# EAGLE design SensorBoard_WiiCam (EAGLE 6.3)

## Sheet 1 of 2
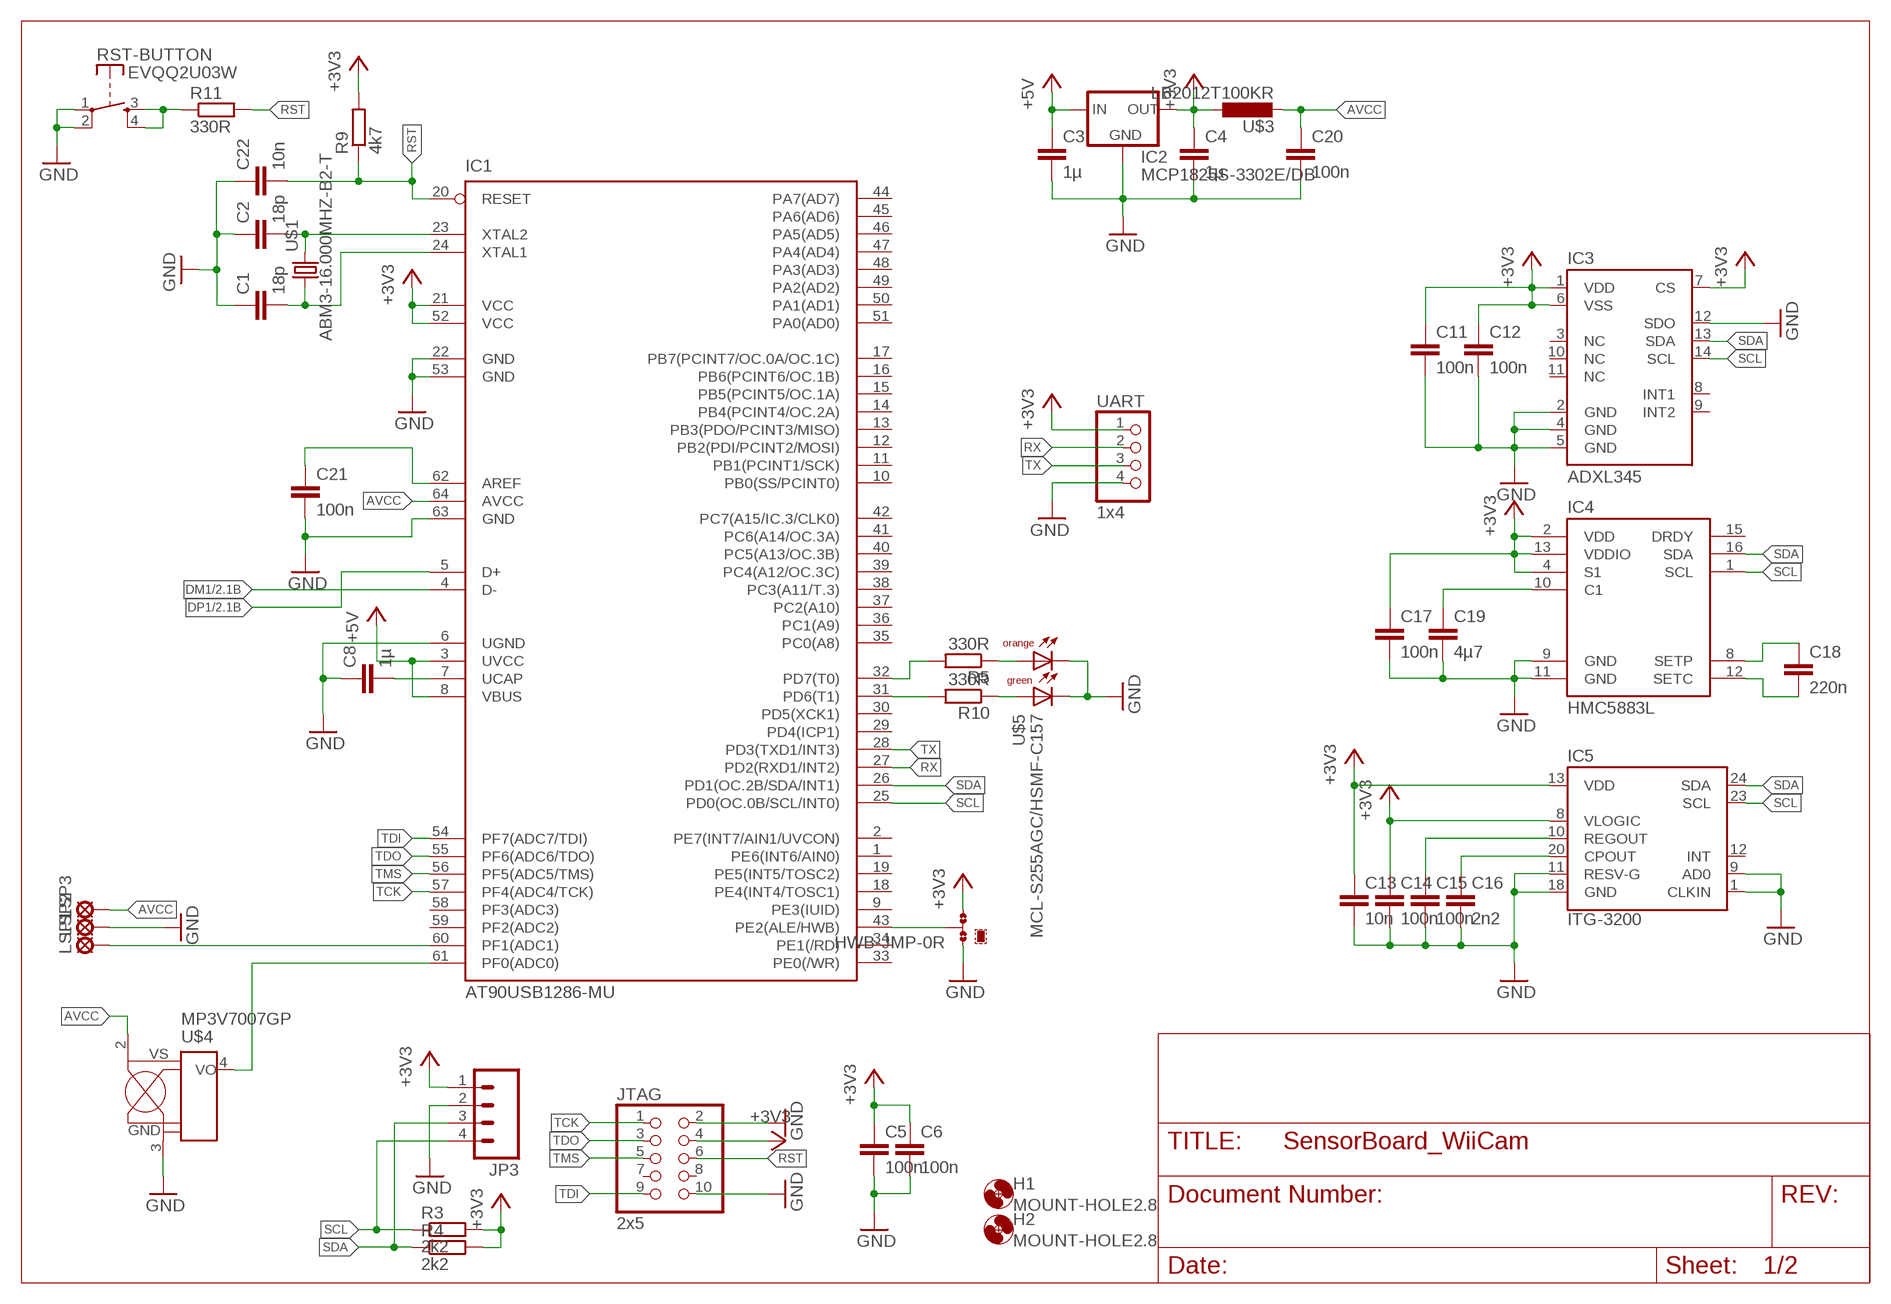
[diagram p0: schematic, sheet 1]

### Parts
C1  18p  C-EUC0603K  [C0603K]
C2  18p  C-EUC0603K  [C0603K]
C3  1µ  C-EUC0603K  [C0603K]
C4  1µ  C-EUC0603K  [C0603K]
C5  100n  C-EUC0603K  [C0603K]
C6  100n  C-EUC0603K  [C0603K]
C8  1µ  C-EUC0603K  [C0603K]
C11  100n  C-EUC0603K  [C0603K]
C12  100n  C-EUC0603K  [C0603K]
C13  10n  C-EUC0603K  [C0603K]
C14  100n  C-EUC0603K  [C0603K]
C15  100n  C-EUC0603K  [C0603K]
C16  2n2  C-EUC0603K  [C0603K]
C17  100n  C-EUC0603K  [C0603K]
C18  220n  C-EUC0603K  [C0603K]
C19  4µ7  C-EUC0603K  [C0603K]
C20  100n  C-EUC0603K  [C0603K]
C21  100n  C-EUC0603K  [C0603K]
C22  10n  C-EUC0603K  [C0603K]
H1  MOUNT-HOLE2.8  [2,8]
H2  MOUNT-HOLE2.8  [2,8]
HWB-JMP  0R-JUMPB  [B0R-JMP]
IC1  AT90USB1286-MU  AT90USB1287-AU  [TQFP64]
IC2  MCP1825S-3302E/DB  MCP1825-SOT223  [SOT223]
IC3  ADXL345  [LGA14]
IC4  HMC5883L  [LPCC16]
IC5  ITG-3200  [QFN-24]
JP3  M04PTH  [1X04]
JTAG  2x5  PINHD-2X5  [2X05]
LSP1  NC  SE14  [SE14]
LSP2  NC  SE14  [SE14]
LSP3  NC  SE14  [SE14]
R3  2k2  R-EU_R0603  [R0603]
R4  2k2  R-EU_R0603  [R0603]
R5  330R  R-EU_R0603  [R0603]
R9  4k7  R-EU_R0603  [R0603]
R10  330R  R-EU_R0603  [R0603]
R11  330R  R-EU_R0603  [R0603]
RST-BUTTON  EVQQ2U03W  SWITCH-SPNO  [EVQQ2]
U$1  ABM3-16.000MHZ-B2-T  TXC_ABM3  [SMD_5X3.2MM]
U$3  LB2012T100KR  L-TAIYO-YUDEN  [L-2012]
U$4  MP3V7007GP  [SOP-8]
U$5  MCL-S255AGC/HSMF-C157  DUOLED-MULTICOMP  [DUOLED-1210]
UART  1x4  PINHD-1X4  [1X04]

### Nets
+3V3: C4.1 C5.1 C6.1 C11.1 C12.1 C13.1 C14.1 C17.1 HWB-JMP.3 IC1.21(VCC) IC1.52(VCC) IC2.3(OUT) IC3.1(VDD) IC3.6(VSS) IC3.7(CS) IC4.2(VDD) IC4.4(S1) IC4.13(VDDIO) IC5.8(VLOGIC) IC5.13(VDD) JP3.1 JTAG.4 R3.2 R4.2 R9.2 U$3.1 UART.1 ; also sheet 2
+5V: C3.1 IC1.3(UVCC) IC1.8(VBUS) IC2.1(IN) ; also sheet 2
AVCC: C20.1 IC1.64(AVCC) LSP3.MP U$3.2 U$4.2(VS)
DM1: IC1.4(D-) ; also sheet 2
DP1: IC1.5(D+) ; also sheet 2
GND: C1.1 C2.1 C3.2 C4.2 C5.2 C6.2 C8.1 C11.2 C12.2 C13.2 C14.2 C15.2 C16.2 C17.2 C19.2 C20.2 C21.2 C22.1 HWB-JMP.1 IC1.6(UGND) IC1.22(GND) IC1.53(GND) IC1.63(GND) IC2.2(GND) IC2.4(GND) IC3.2(GND) IC3.4(GND) IC3.5(GND) IC3.12(SDO) IC4.9(GND) IC4.11(GND) IC5.1(CLKIN) IC5.9(AD0) IC5.11(RESV-G) IC5.18(GND) JP3.2 JTAG.2 JTAG.10 LSP2.MP RST-BUTTON.1(P) RST-BUTTON.2(P) U$4.3(GND) U$5.1(C) U$5.2(C) UART.4 ; also sheet 2
N$1: C1.2 IC1.24(XTAL1) U$1.P$1
N$2: C2.2 IC1.23(XTAL2) U$1.P$2
N$3: C8.2 IC1.7(UCAP)
N$4: C16.1 IC5.20(CPOUT)
N$5: C18.1 IC4.8(SETP)
N$10: C15.1 IC5.10(REGOUT)
N$11: C18.2 IC4.12(SETC)
N$12: R5.1 U$5.4(AO)
N$13: C19.1 IC4.10(C1)
N$15: C21.1 IC1.62(AREF)
N$16: HWB-JMP.2 IC1.43(PE2(ALE/HWB))
N$17: IC1.31(PD6(T1)) R10.2
N$18: R10.1 U$5.3(AG)
N$19: IC1.32(PD7(T0)) R5.2
N$20: R11.1 RST-BUTTON.3(S) RST-BUTTON.4(S)
N$21: IC1.61(PF0(ADC0)) U$4.4(OUT)
N$22: IC1.60(PF1(ADC1)) LSP1.MP
RST: C22.2 IC1.20(RESET) JTAG.6 R9.1 R11.2
RX: IC1.27(PD2(RXD1/INT2)) UART.2
SCL: IC1.25(PD0(OC.0B/SCL/INT0)) IC3.14(SCL) IC4.1(SCL) IC5.23(SCL) JP3.4 R3.1
SDA: IC1.26(PD1(OC.2B/SDA/INT1)) IC3.13(SDA) IC4.16(SDA) IC5.24(SDA) JP3.3 R4.1
TCK: IC1.57(PF4(ADC4/TCK)) JTAG.1
TDI: IC1.54(PF7(ADC7/TDI)) JTAG.9
TDO: IC1.55(PF6(ADC6/TDO)) JTAG.3
TMS: IC1.56(PF5(ADC5/TMS)) JTAG.5
TX: IC1.28(PD3(TXD1/INT3)) UART.3
Unconnected: IC1.1(PE6(INT6/AIN0)) IC1.2(PE7(INT7/AIN1/UVCON)) IC1.9(PE3(IUID)) IC1.10(PB0(SS/PCINT0)) IC1.11(PB1(PCINT1/SCK)) IC1.12(PB2(PDI/PCINT2/MOSI)) IC1.13(PB3(PDO/PCINT3/MISO)) IC1.14(PB4(PCINT4/OC.2A)) IC1.15(PB5(PCINT5/OC.1A)) IC1.16(PB6(PCINT6/OC.1B)) IC1.17(PB7(PCINT7/OC.0A/OC.1C)) IC1.18(PE4(INT4/TOSC1)) IC1.19(PE5(INT5/TOSC2)) IC1.29(PD4(ICP1)) IC1.30(PD5(XCK1)) IC1.33(PE0(/WR)) IC1.34(PE1(/RD)) IC1.35(PC0(A8)) IC1.36(PC1(A9)) IC1.37(PC2(A10)) IC1.38(PC3(A11/T.3)) IC1.39(PC4(A12/OC.3C)) IC1.40(PC5(A13/OC.3B)) IC1.41(PC6(A14/OC.3A)) IC1.42(PC7(A15/IC.3/CLK0)) IC1.44(PA7(AD7)) IC1.45(PA6(AD6)) IC1.46(PA5(AD5)) IC1.47(PA4(AD4)) IC1.48(PA3(AD3)) IC1.49(PA2(AD2)) IC1.50(PA1(AD1)) IC1.51(PA0(AD0)) IC1.58(PF3(ADC3)) IC1.59(PF2(ADC2)) IC3.3(NC) IC3.8(INT1) IC3.9(INT2) IC3.10(NC) IC3.11(NC) IC4.15(DRDY) IC5.12(INT) JTAG.7 JTAG.8

## Sheet 2 of 2
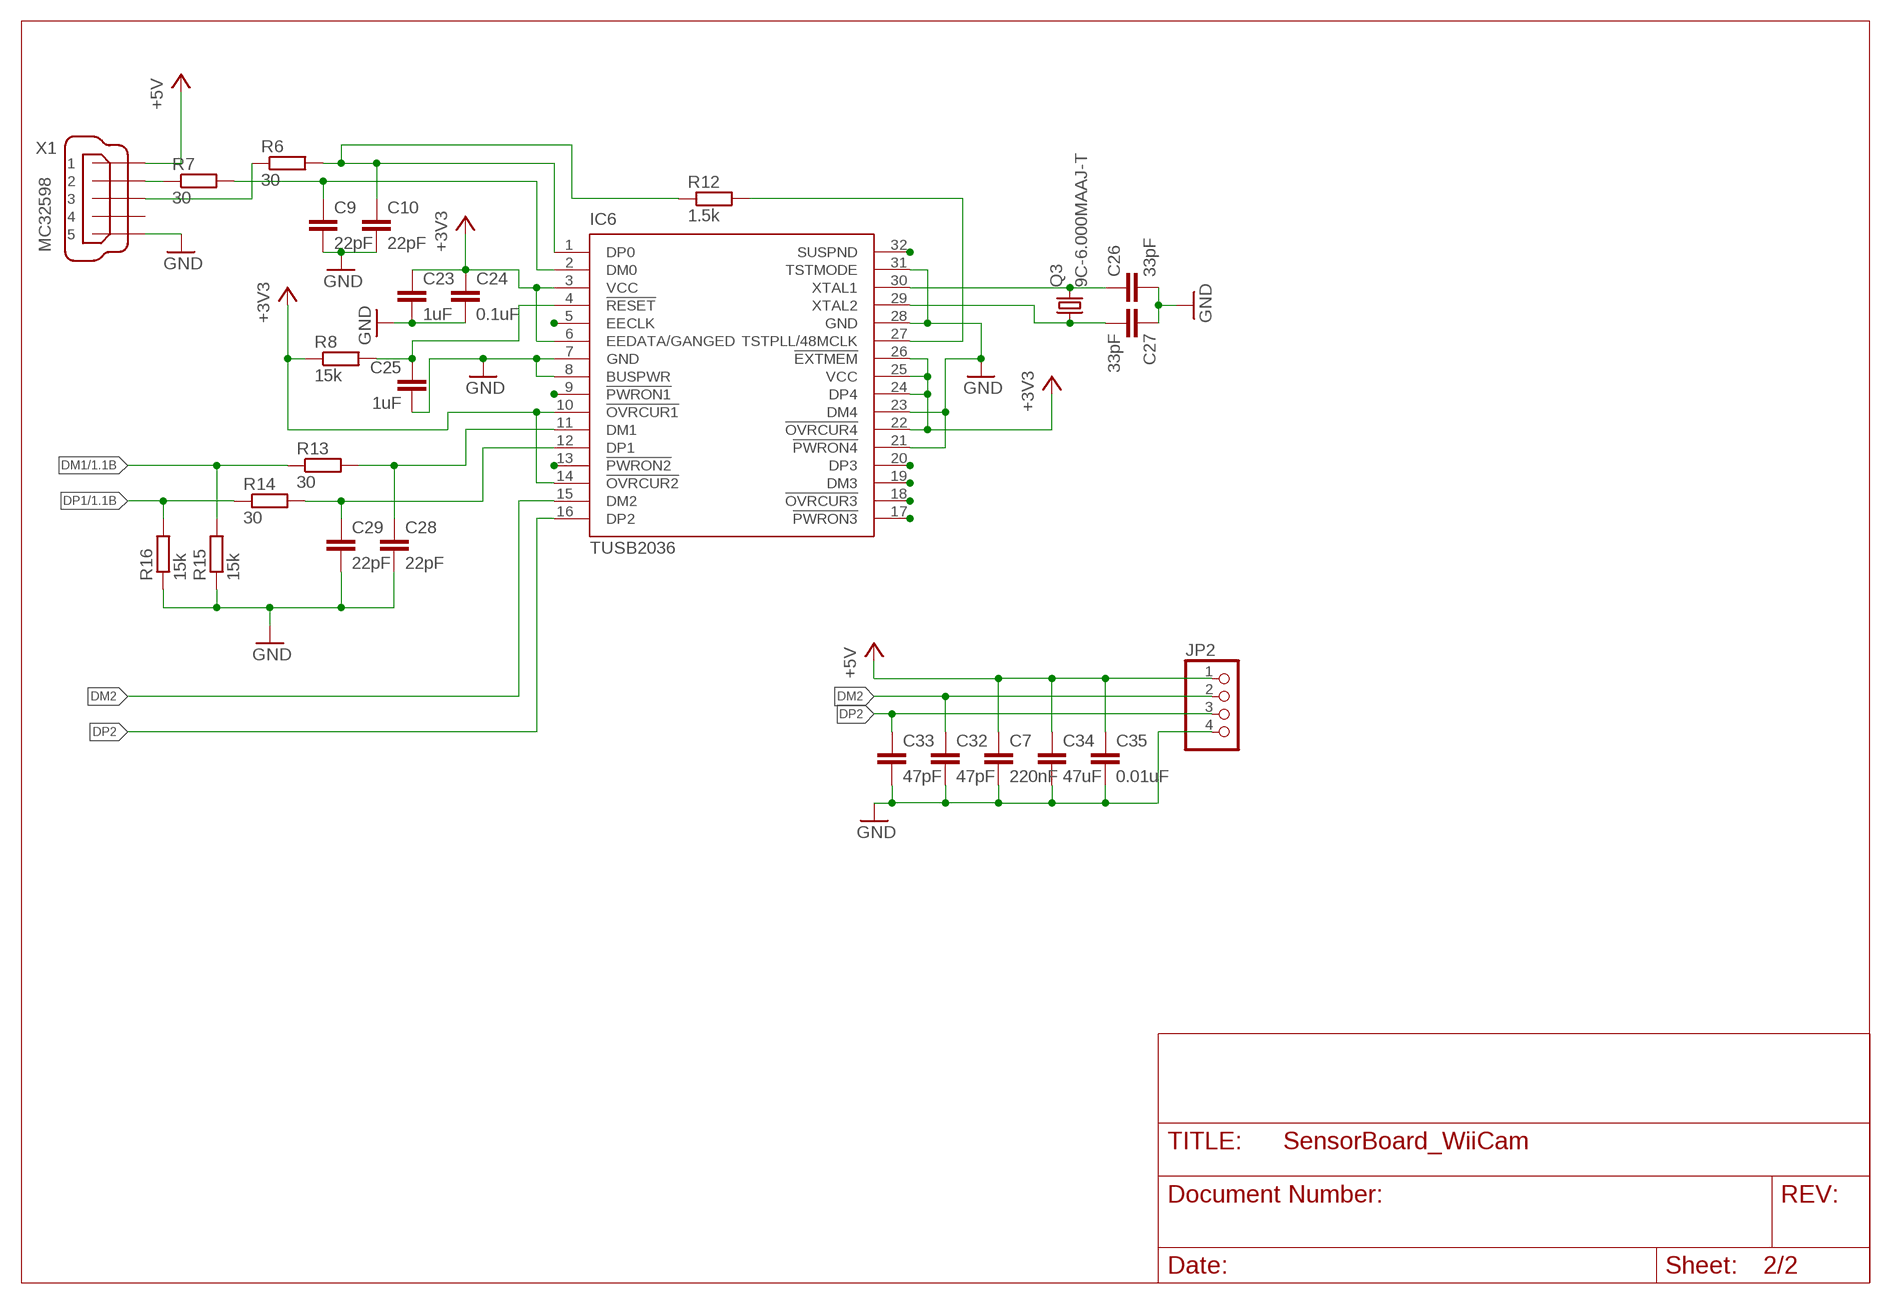
[diagram p1: schematic, sheet 2]

### Parts
C7  220nF  C-EUC0603  [C0603]
C9  22pF  C-EUC0603  [C0603]
C10  22pF  C-EUC0603  [C0603]
C23  1uF  C-EUC0603  [C0603]
C24  0.1uF  C-EUC0603  [C0603]
C25  1uF  C-EUC0603  [C0603]
C26  33pF  C-EUC0603  [C0603]
C27  33pF  C-EUC0603  [C0603]
C28  22pF  C-EUC0603  [C0603]
C29  22pF  C-EUC0603  [C0603]
C32  47pF  C-EUC0603  [C0603]
C33  47pF  C-EUC0603  [C0603]
C34  47uF  C-EUC0805  [C0805]
C35  0.01uF  C-EUC0603  [C0603]
IC6  TUSB2036  TUSB2046BVFR  [VF_S-PQFP-G32]
JP2  PINHD-1X4  [1X04]
Q3  9C-6.000MAAJ-T  CSM-7X-DU  [CSM-7X-DU]
R6  30  R-EU_R0603  [R0603]
R7  30  R-EU_R0603  [R0603]
R8  15k  R-EU_R0603  [R0603]
R12  1.5k  R-EU_R0603  [R0603]
R13  30  R-EU_R0603  [R0603]
R14  30  R-EU_R0603  [R0603]
R15  15k  R-EU_R0603  [R0603]
R16  15k  R-EU_R0603  [R0603]
X1  MC32598  MINI-USB-32005-201  [32005-201]

### Nets
+3V3: C23.1 C24.1 IC6.3(VCC) IC6.6(EEDATA/GANGED) IC6.10(!OVRCUR1) IC6.14(!OVRCUR2) IC6.22(!OVRCUR4) IC6.24(DP4) IC6.25(VCC) IC6.26(!EXTMEM) R8.1 ; also sheet 1
+5V: C7.1 C34.1 C35.1 JP2.1 X1.1 ; also sheet 1
DM1: R13.1 R15.2 ; also sheet 1
DM2: C32.1 IC6.15(DM2) JP2.2
DP1: R14.1 R16.2 ; also sheet 1
DP2: C33.1 IC6.16(DP2) JP2.3
GND: C7.2 C9.2 C10.2 C23.2 C24.2 C25.2 C26.2 C27.1 C28.2 C29.2 C32.2 C33.2 C34.2 C35.2 IC6.7(GND) IC6.8(BUSPWR) IC6.21(!PWRON4) IC6.23(DM4) IC6.28(GND) IC6.31(TSTMODE) JP2.4 R15.1 R16.1 X1.5 ; also sheet 1
N$23: C9.1 IC6.2(DM0) R7.2
N$26: R7.1 X1.2
N$27: R6.1 X1.3
N$28: C10.1 IC6.1(DP0) R6.2 R12.1
N$29: C25.1 IC6.4(!RESET) R8.2
N$30: IC6.5(EECLK)
N$31: C26.1 IC6.30(XTAL1) Q3.2
N$32: C27.2 IC6.29(XTAL2) Q3.1
N$33: IC6.27(TSTPLL/48MCLK) R12.2
N$34: IC6.32(SUSPND)
N$35: IC6.20(DP3)
N$36: IC6.19(DM3)
N$37: IC6.18(!OVRCUR3)
N$38: IC6.17(!PWRON3)
N$39: IC6.9(!PWRON1)
N$40: IC6.13(!PWRON2)
N$41: C28.1 IC6.11(DM1) R13.2
N$42: C29.1 IC6.12(DP1) R14.2
Unconnected: X1.4

## Library data of the parts
C1-C29 C32-C35 = rcl:C-EU: CAPACITOR, European symbol
H1 H2 = holes:MOUNT-HOLE: MOUNTING HOLE with drill center marker
HWB-JMP = jump-0r-smd:0R-JUMP: SMD 0R 0805 Jumper
IC1 = Sensorboard:AT90USB1287-*: Atmel AT90USB1287 AVR Microcontroller with USB Interface and 128kB Flash Memory
IC2 = Sensorboard:MCP1825-SOT223: VOLTAGE REGULATOR Output: 3.3V; 500 mA
IC3 = Sensorboard:ADXL345
IC4 = Sensorboard:HMC5883L: 3-Axis Digital Compass IC Honeywell HMC5883L I2C digital interface
IC5 = Sensorboard:ITG-3200: ITG-3200 3-axis gyro, digital output, qfn24 package
IC6 = texas:TUSB2046B: 4-PORT HUB FOR THE UNIVERSAL SERIAL BUS WITH OPTIONAL SERIAL EEPROM INTERFACE Auto generated by make-symbol-device-package-bsdl.ulp Rev. 30 Source: http://focus.ti.com/lit/ds/symlink/tusb2046b.pdf; MF: TEXAS INSTRUMENTS; MPN: TUSB2046BVFR; OC_FARNELL: 1470507; OC_NEWARK: 77C1806
JP2 UART = pinhead:PINHD-1X4: PIN HEADER
JP3 = SparkFun:M04: Header 4 Standard 4-pin 0.1" header. Use with straight break away headers (SKU : PRT-00116), right angle break away headers (PRT-00553), swiss pins (PRT-00743), machine pins (PRT-00117), and female headers (PRT-00115). Molex polarized connector foot print use with SKU : PRT-08231 with associated crimp pins and housings.
JTAG = pinhead:PINHD-2X5: PIN HEADER
LSP1-LSP3 = solpad:SE14: SOLDER PAD E1553, drill 1,4mm, distributor Buerklin, 07F820
Q3 = crystal:CSM-7X-DU: SMD CRYSTAL Source: www.ecsxtal.com .. Crystal 3.6864MHz CSM_7X_DU.PDF; OC_FARNELL: unknown; OC_NEWARK: unknown
R3-R16 = rcl:R-EU_: RESISTOR, European symbol
RST-BUTTON = Sensorboard:SWITCH-SPNO: Switch - SPNO Panasonic EVQQ2T03W SMD package 6.5x6mm
U$1 = Sensorboard:TXC_ABM3
U$3 = Sensorboard:L-TAIYO-YUDEN: Inductance Manufacturer: Taiyo Yuden; package: 2012, 2x1.25 mm
U$4 = Sensorboard:MP3V7007GP: MP3V7007GP Pressure Sensor Freescale gauge type pressure sensor range -7 to 7 kPa (-1 to 1 psi); Vs 3V Out 0.2 to 2.8V
U$5 = Sensorboard:DUOLED-MULTICOMP: LED orange/green MULTICOMP - MCL-S255AGC - LED,SMD,1210,ORANGE/GRUEN Hersteller: MULTICOMP Farnell Best.Nr.: 1581234 Herst.Bez.: MCL-S255AGC
X1 = con-cypressindustries:MINI-USB-: MINI USB-B Conector Source: www.cypressindustries.com; OC_FARNELL: unknown; OC_NEWARK: unknown

## Board
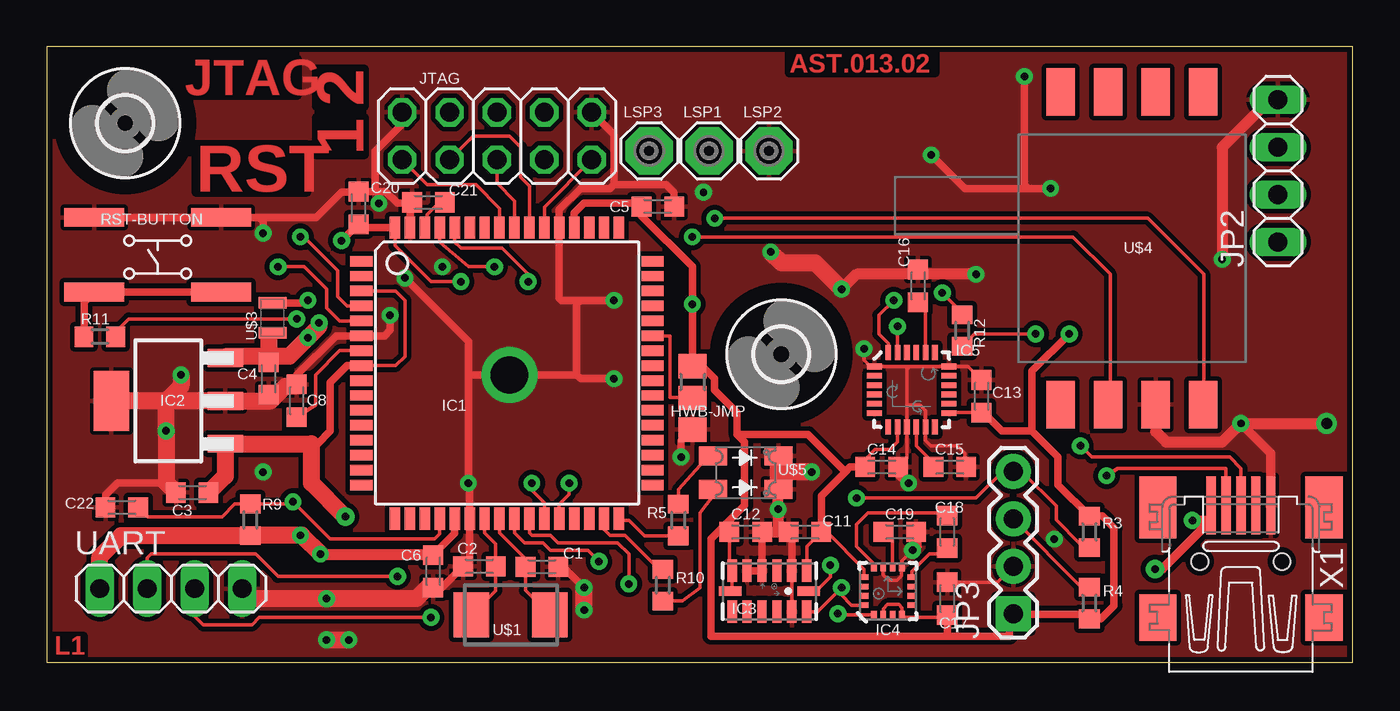
[diagram p2: board, top side]
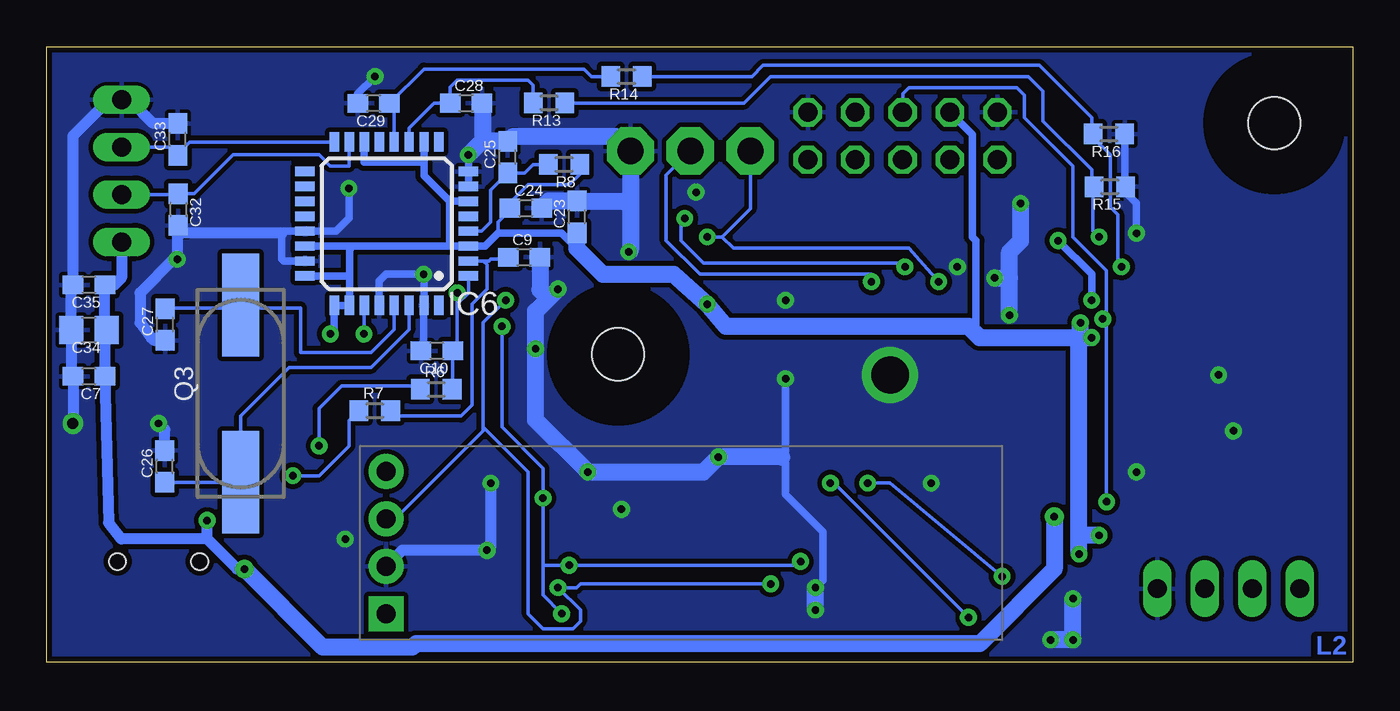
[diagram p3: board, bottom side, seen from below]

Size 70 x 33 mm. Coordinates in mm from the lower left corner, seen from the top.
Outline: 0,33 0,0 70,0 70,33 0,33
Copper layers (1*16): Top 0.035mm / dielectric 1.5mm / Bottom 0.035mm
Design rules "default *": minimum track width 0.2mm, minimum drill 0.3mm, track to track 0.2mm, track to pad 0.2mm, pad to pad 0.2mm, via to via 0.2mm, smd to smd 0mil, copper to edge 0.3mm, drill to drill 0.2mm, minimum pad ring 0.25mm, minimum via ring 0.25mm, stop-mask expansion 2mil, vias tented up to drill 0.6mm, thermal gap 0.2mm

### Footprints (pad centres in the part's own frame; a part is rotated, then mirrored left to right if it is on the bottom)
C0603K = smd 1.05 x 1.08: 1 -0.875,0; 2 0.875,0
C0603 = smd 1.1 x 1: 1 -0.85,0; 2 0.85,0
C0805 = smd 1.3 x 1.5: 1 -0.95,0; 2 0.95,0
2,8 = hole 2.8: 0,0
B0R-JMP = smd 1.5 x 1.3: 1 0,1.7; 2 0,0; 3 0,-1.7
TQFP64 = smd 1.194 x 0.559: 1 -7.8,6; 2 -7.8,5.2; 3 -7.8,4.4; 4 -7.8,3.6; 5 -7.8,2.8; 6 -7.8,2; 7 -7.8,1.2; 8 -7.8,0.4; 9 -7.8,-0.4; 10 -7.8,-1.2; 11 -7.8,-2; 12 -7.8,-2.8; 13 -7.8,-3.6; 14 -7.8,-4.4; 15 -7.8,-5.2; 16 -7.8,-6; 33 7.8,-6; 34 7.8,-5.2; 35 7.8,-4.4; 36 7.8,-3.6; 37 7.8,-2.8; 38 7.8,-2; 39 7.8,-1.2; 40 7.8,-0.4; 41 7.8,0.4; 42 7.8,1.2; 43 7.8,2; 44 7.8,2.8; 45 7.8,3.6; 46 7.8,4.4; 47 7.8,5.2; 48 7.8,6 | smd 0.559 x 1.194: 17 -6,-7.8; 18 -5.2,-7.8; 19 -4.4,-7.8; 20 -3.6,-7.8; 21 -2.8,-7.8; 22 -2,-7.8; 23 -1.2,-7.8; 24 -0.4,-7.8; 25 0.4,-7.8; 26 1.2,-7.8; 27 2,-7.8; 28 2.8,-7.8; 29 3.6,-7.8; 30 4.4,-7.8; 31 5.2,-7.8; 32 6,-7.8; 49 6,7.8; 50 5.2,7.8; 51 4.4,7.8; 52 3.6,7.8; 53 2.8,7.8; 54 2,7.8; 55 1.2,7.8; 56 0.4,7.8; 57 -0.4,7.8; 58 -1.2,7.8; 59 -2,7.8; 60 -2.8,7.8; 61 -3.6,7.8; 62 -4.4,7.8; 63 -5.2,7.8; 64 -6,7.8
SOT223 = smd 0.95 x 1.9: 1 -2.3,-3.05; 2 0,-3.05; 3 2.3,-3.05 | smd 3.2 x 1.9: 4 0,3.05
LGA14 = smd 0.5 x 1.2: 1 2,1.1; 2 1.2,1.1; 3 0.4,1.1; 4 -0.4,1.1; 5 -1.2,1.1; 6 -2,1.1; 8 -2,-1.1; 9 -1.2,-1.1; 10 -0.4,-1.1; 11 0.4,-1.1; 12 1.2,-1.1; 13 2,-1.1 | smd 1.2 x 0.5: 7 -2.1,0; 14 2.1,0
LPCC16 = smd 0.45 x 0.3: 1 -1.275,0.75; 2 -1.275,0.25; 3 -1.275,-0.25; 4 -1.275,-0.75; 9 1.275,-0.75; 10 1.275,-0.25; 11 1.275,0.25; 12 1.275,0.75 | smd 0.3 x 0.45: 5 -0.75,-1.275; 6 -0.25,-1.275; 7 0.25,-1.275; 8 0.75,-1.275; 13 0.75,1.275; 14 0.25,1.275; 15 -0.25,1.275; 16 -0.75,1.275
QFN-24 = smd 0.8 x 0.3: 1 -2,1.25; 2 -2,0.75; 3 -2,0.25; 4 -2,-0.25; 5 -2,-0.75; 6 -2,-1.25; 13 2,-1.25; 14 2,-0.75; 15 2,-0.25; 16 2,0.25; 17 2,0.75; 18 2,1.25 | smd 0.3 x 0.8: 7 -1.25,-2; 8 -0.75,-2; 9 -0.25,-2; 10 0.25,-2; 11 0.75,-2; 12 1.25,-2; 19 1.25,2; 20 0.75,2; 21 0.25,2; 22 -0.25,2; 23 -0.75,2; 24 -1.25,2
VF_S-PQFP-G32 = smd 1.05 x 0.5: 1 -4.375,2.8; 2 -4.375,2; 3 -4.375,1.2; 4 -4.375,0.4; 5 -4.375,-0.4; 6 -4.375,-1.2; 7 -4.375,-2; 8 -4.375,-2.8; 17 4.375,-2.8; 18 4.375,-2; 19 4.375,-1.2; 20 4.375,-0.4; 21 4.375,0.4; 22 4.375,1.2; 23 4.375,2; 24 4.375,2.8 | smd 0.5 x 1.05: 9 -2.8,-4.375; 10 -2,-4.375; 11 -1.2,-4.375; 12 -0.4,-4.375; 13 0.4,-4.375; 14 1.2,-4.375; 15 2,-4.375; 16 2.8,-4.375; 25 2.8,4.375; 26 2,4.375; 27 1.2,4.375; 28 0.4,4.375; 29 -0.4,4.375; 30 -1.2,4.375; 31 -2,4.375; 32 -2.8,4.375
1X04 = drill 1.016 long: 1 -3.81,0; 2 -1.27,0; 3 1.27,0; 4 3.81,0
1X04' = drill 1.016 pad 1.88 square: 1 0,0 | drill 1.016 pad 1.88: 2 2.54,0; 3 5.08,0; 4 7.62,0
2X05 = drill 1.016 octagon: 1 -5.08,-1.27; 2 -5.08,1.27; 3 -2.54,-1.27; 4 -2.54,1.27; 5 0,-1.27; 6 0,1.27; 7 2.54,-1.27; 8 2.54,1.27; 9 5.08,-1.27; 10 5.08,1.27
SE14 = drill 1.397 pad 2.54 octagon: MP 0,0
CSM-7X-DU = smd 5.5 x 2: 1 -4.75,0; 2 4.75,0
R0603 = smd 1 x 1.1: 1 -0.85,0; 2 0.85,0
EVQQ2 = smd 3.2 x 1: 1 -3.4,2; 2 3.4,2; 3 3.4,-2; 4 -3.4,-2
SMD_5X3.2MM = smd 1.9 x 2.4: P$1 -2.1,0; P$2 2.1,0
L-2012 = smd 0.6 x 1.5: 1 -0.8,0; 2 0.8,0
SOP-8 = smd 2.54 x 1.524: 1 8.382,-3.81; 2 8.382,-1.27; 3 8.382,1.27; 4 8.382,3.81; 5 -8.382,3.81; 6 -8.382,1.27; 7 -8.382,-1.27; 8 -8.382,-3.81
DUOLED-1210 = smd 1.5 x 1: 1 -1.75,-0.9; 2 -1.75,0.9; 3 1.75,0.9; 4 1.75,-0.9
32005-201 = smd 3.1 x 0.5: 1 3,1.6; 2 3,0.8; 3 3,0; 4 3,-0.8; 5 3,-1.6 | smd 2.5 x 2: M1 -3,-4.45; M2 -3,4.45 | smd 3.3 x 2: M3 2.9,4.45; M4 2.9,-4.45 | hole 0.9: 0,2.2; 0,-2.2

### Placement (x,y rotation side)
C1  26.54,5.12 180 top
C2  23.19,5.14 0 top
C3  7.8,9.09 180 top
C4  11.9,15.21 270 top
C5  32.76,24.43 0 top
C6  20.71,4.87 270 top
C7  67.73,15.33 180 bottom
C8  13.4,14.02 270 top
C9  44.42,21.71 0 bottom
C10  49.09,16.69 180 bottom
C11  40.64,6.99 180 top
C12  37.47,6.99 0 top
C13  50.1,14.26 90 top
C14  44.75,10.46 0 top
C15  48.4,10.46 0 top
C16  46.7,20.18 90 top
C17  48.26,3.41 90 top
C18  48.26,6.99 90 top
C19  45.72,6.99 0 top
C20  16.72,24.36 90 top
C21  20.46,24.65 180 top
C22  4.03,8.3 0 top
C23  41.57,23.87 90 bottom
C24  44.33,24.35 0 bottom
C25  45.29,27.07 90 bottom
C26  63.67,10.5 90 bottom
C27  63.64,18.1 90 bottom
C28  47.53,29.97 0 bottom
C29  52.47,29.96 180 bottom
C32  62.95,24.27 270 bottom
C33  62.97,28.03 90 bottom
C34  67.73,17.8 180 bottom
C35  67.73,20.23 180 bottom
H1  4.21,28.9 0 top
H2  39.37,16.51 0 top
HWB-JMP  34.62,14.17 180 top
IC1  24.67,15.5 0 top
IC2  6.52,14.01 90 top
IC3  38.73,3.81 0 top
IC4  45.09,3.81 90 top
IC5  46.35,14.61 0 top
IC6  51.78,23.51 180 bottom
JP2  65.99,26.34 90 top
JP3  [1X04']  51.8,2.6 90 top
JTAG  24.13,28.21 0 top
LSP1  35.5,27.41 0 top
LSP2  38.71,27.41 0 top
LSP3  32.29,27.41 0 top
Q3  59.6,14.4 270 bottom
R3  55.88,6.99 90 top
R4  55.88,3.17 270 top
R5  33.85,7.62 270 top
R6  49.12,14.62 0 bottom
R7  52.42,13.48 0 bottom
R8  42.27,26.68 180 bottom
R9  10.92,7.63 270 top
R10  33.02,4.13 90 top
R11  2.85,17.46 0 top
R12  49.06,17.78 270 top
R13  43.07,29.98 180 bottom
R14  38.93,31.39 180 bottom
R15  13.02,25.49 180 bottom
R16  13.07,28.31 180 bottom
RST-BUTTON  5.95,21.84 0 top
U$1  24.87,2.54 180 top
U$3  12.11,18.46 90 top
U$4  58.16,22.19 270 top
U$5  37.47,10.16 180 top
UART  6.66,3.95 0 top
X1  64,5.4 90 top

### Tracks (layer width: path | path; a pad name or v marks a point on that pad's centre or on a via)
+3V3  (via drill 0.4, 0.4 pad 0.81, 0.4 pad 0.9)
  Top 0.2: IC4.4 | IC4.4 45.84,2.92 45.66,3.09 45.06,3.09 44.84,2.86 IC4.2 | IC3.7 36.73,3.91 IC3.6 36.59,5.05 C12.1 | IC4.4 45.97,2.4 48.12,2.4 C17.1 | IC5.8 45.6,11.8 45.2,11.4 44.4,11.4 43.88,10.88 C14.1 | 40.91,4.91 IC3.1 40.73,6.21 C11.1 41.81,6.99 43.81,4.99 IC4.13 | R4.2 55.43,2.58 | IC5.13 48.38,13.38 C13.1 50.22,13.38 50.4,13.2
  Top 0.4: IC1.52 28.27,24.07 28.8,24.6 31.71,24.6 C5.1 31.88,23.92 | IC1.21 21.87,6.9 C6.1 | 52.8,15.6 v54.8,17.6 | C17.1 48.26,1.46 48.2,1.4
  Top 0.406: 36.59,7.59 37.4,8.4 37.4,11.8 37,12.2 | C12.1 36.59,7.59 | R4.2 56.49,2.33 57.2,3.04 57.2,7.2 56.56,7.83 R3.2 54.2,9.52 54.2,11 52.8,12.4 | 11.66,17.54 U$3.1 11.89,17.45 | 36.59,7.59 35.6,6.6 35.6,1.4 48.2,1.4 51.6,1.4 51.6,2.4 JP3.1 51.83,2.58 55.43,2.58 | 37,12.2 40.8,12.2 42.8,10.2 | C11.1 41.52,8.91 42.8,10.2 | C14.1 43.06,10.46 42.8,10.2 | 52.8,12.4 51.2,12.4 50.4,13.2 | 52.8,15.6 52.8,12.4 | 37,12.2 37,13.4 35.8,14.6 35.8,15.2 35.2,15.8 34.69,15.8 HWB-JMP.3 34.62,19.02 v34.6,19.2 34.6,21.2 31.88,23.92 | 10.94,6.8 R9.2
  Top 0.6: C6.1 14.73,5.75 v14.67,5.8
  Top 0.9: R9.2 3.98,6.78 2.85,5.65 UART.1 | 10.94,6.8 v13.6,6.8 13.67,6.8 v14.67,5.8 | 11.8,16.4 13,16.4 v14,17.4 14.6,18 v14.6,18.2 | 11.8,16.4 9.66,16.4 IC2.3 | 11.8,16.4 11.9,16.3 C4.1 11.89,17.45
  Bottom 0.2: 45.8,23 45.8,23.6 45.18,24.22 C24.1 45,24.52 45,24.8 44.2,25.6 42,25.6 41.42,26.18 R8.1 | 41.6,23 C23.1 | IC6.14 53,27.88
  Bottom 0.4: 53,27.88 53,26.8 49.78,26.8 | 49.78,26.8 IC6.10 | IC6.6 48.4,24.71 | 48.4,22.31 IC6.3 46.49,22.31 45.8,23 42.4,23 41.6,22.2 | 48.4,22.31 48.4,24.71 | 49.78,26.8 49.78,26.08 48.4,24.71 | IC6.22 53.6,22.31 | 53.6,22.31 48.4,22.31 | 53.78,20.8 IC6.26 IC6.25 | 53.78,20.8 53.78,22.13 53.6,22.31 | 54.6,19.11 54.6,17.8 v54.8,17.6 | IC6.24 53.87,20.71 53.78,20.8
  Bottom 0.406: 20.2,17.6 20.2,22.6 20.4,22.8 20.4,28.29 JTAG.4 | 54.6,19.11 IC6.25
  Bottom 0.9: v14.67,5.8 14.67,17.33 14.6,17.4 | 41.6,23 41.6,22.2 | 14.6,17.4 20,17.4 20.2,17.6 20.6,18 33.6,18 v34.6,19.2 36.4,20.8 40.2,20.8 41.6,22.2 | 14.6,17.4 v14,17.4 | 14.6,17.4 v14.6,18.2 | v13.6,6.8 14.6,6.8
+5V  (via drill 0.4 pad 0.9, 0.4 pad 1)
  Top 0.2: IC1.3 18.7,19.9 19.2,19.4 19.2,16.4 18.7,15.9 IC1.8
  Top 0.406: 14.2,11.71 14.51,11.71 15.2,12.4 15.2,15 16.1,15.9 IC1.8
  Top 0.5: v59.4,5 59.8,5 62.4,7.6 | X1.1 62.4,7.6 | 62.4,7.6 v61.4,7.6
  Top 0.9: C3.1 9.57,9.98 IC2.1 14.2,11.71 14.2,9.6 v16,7.8
  Bottom 0.406: 66.85,20.2 C35.1 | C34.1 66.88,17.8
  Bottom 0.6: JP2.1 65.99,20.61 66.4,20.2 66.85,20.2 | v59.4,5 59.8,5 61.4,6.6 | 61.4,6.6 66,6.6 66.68,7.48 C7.1 66.88,17.8 C35.1 | 61.4,6.6 v61.4,7.6
  Bottom 0.9: v59.4,5 55.2,0.8 50.4,0.8 50.2,1 20,1 16,5 v16,7.8
AVCC  (via drill 0.4, 0.4 pad 0.81)
  Top 0.2: U$4.2 57,13.92 57,20.8 55,22.8 v34.6,22.8 | IC1.64 18.67,22.33 20.6,20.4 v22.2,20.4
  Top 0.4: IC1.64 16.9,23.3 C20.1 16.68,23.48 v15.8,22.6
  Top 0.406: U$3.2 13.87,19.27 v14,19.4
  Bottom 0.2: v22.2,20.4 23.8,22.2 33.2,22.2 33.8,22.8 | LSP3.MP 32.29,24.31 33.8,22.8 | v34.6,22.8 33.8,22.8
  Bottom 0.406: v14,19.4 14,20.8 v15.8,22.6
DM1  (via drill 0.4)
  Top 0.2: IC1.4 16.1,19.1 15.6,19.6 15.6,21 13.8,22.8 v13.6,22.8
  Bottom 0.2: R13.1 32.62,29.98 31.2,31.4 17.4,31.4 16.6,30.6 16.6,29 14,26.4 14,25.61 R15.2 13.92,25.44 13.92,23.12 v13.6,22.8
DM2
  Bottom 0.2: JP2.2 62.95,25.07 C32.1 62.08,25.12 60,27.2 55.4,27.2 54.8,26.6 53.8,26.6 53.8,27.91 IC6.15
DP1  (via drill 0.4)
  Top 0.2: v12.4,21.2 13.8,21.2 15,20 15,19 15.7,18.3 IC1.5
  Bottom 0.2: R14.1 32.21,31.39 31.6,32 16.8,32 14,29.2 14,28.39 R16.2 13.92,28.12 13,27.2 13,24.4 12.6,24 12.6,21.4 v12.4,21.2
DP2
  Bottom 0.2: JP2.3 63.4,27.61 C33.1 62.97,27.25 62.34,27.88 IC6.16
GND  (via drill 0.4, 0.4 pad 0.81, 0.4 pad 0.9, 0.6 pad 0.81, 2 pad 3)
  Top 0.2: IC4.11 44.81,5.07 44.81,4.69 45.12,4.39 45.56,4.39 45.81,4.64 45.81,5.07 IC4.9 45.84,5.44 v46.4,6 | IC3.2 IC3.12 | v43.8,16.8 43.8,16.2 44.15,15.86 IC5.1 46,15.86 | IC5.9 46.1,13.8 46.8,13.8 47.1,13.49 IC5.11 47.1,11.89 47.4,11.6 48.8,11.6 49.2,11.2 49.2,10.53 C15.2 | IC5.9 46.1,10.94 C14.2 | C13.2 49.38,15.86 IC5.18 46,15.86 | C17.2 50.95,4.29 JP3.2 | IC5.9 46.1,15.71 | 46.1,15.71 46.2,15.8 | 46.1,15.71 46.1,15.75 46,15.86
  Top 0.4: 30.4,25.6 30.2,25.4 28.6,25.4 27.47,24.27 IC1.53 27.47,19.53 27.6,19.4 28.6,19.4 | 30.4,25.6 30.4,28.29 JTAG.10 | 28.6,19.4 v30.4,19.4 | v34,11 34,11.85 HWB-JMP.1 | C1.1 27.68,5.12 v28.8,4 | 11.4,23.84 RST-BUTTON.2 RST-BUTTON.1 | 11.4,23.84 14.45,23.84 15.8,25.2 16.69,25.2 C20.2 17.6,25.23 | 17.6,25.23 17.8,25.23 | 17.8,25.23 18.17,25.23 18.8,24.6 19.54,24.6 C21.2 19.47,24.54 IC1.63 | JTAG.2 19.05,28.85 17.6,27.4 17.6,25.23 | v17.8,24.6 17.8,25.23 | v18.4,18.6 18.4,17.8 18.1,17.5 IC1.6 15.5,17.5 13.4,15.4 C8.1 | 28.4,15.4 v24.8,15.4 22.6,15.4 | 28.4,15.4 28.4,19.2 28.6,19.4 | v30.4,15.2 28.6,15.2 28.4,15.4 | 22.6,15.4 v22.6,9.6 22.67,9.53 IC1.22 22.67,5.5 C2.1 21.17,4 C6.2 | 22.6,15.4 22.6,17.2 v19.2,20.6 | C5.2 33.63,25.17 33.2,25.6 30.4,25.6 | C22.1 3.16,8.96 3.8,9.6 6.38,9.6 6.4,9.62 | C12.2 IC3.4 IC3.5 | IC3.2 39.94,6.82 C11.2 | v53.8,25.4 52.6,25.4 | 52.6,25.4 49.2,25.4 v47.4,27.2 | v52.4,31.4 52.4,25.6 52.6,25.4 | v11.6,23 11.6,23.64 11.4,23.84
  Top 0.5: X1.5 65.6,11.2 v64,12.8
  Top 0.6: C12.2 39.2,6.99 | 39.2,6.99 C11.2 | 39.2,6.99 v39.2,8.2 39.2,9.24 U$5.2 | C19.2 46.59,6.2 v46.4,6 | JP2.4 65.55,30.15 63,27.6 v63,21.6 | v68.6,12.8 v64,12.8 63,11.8 60,11.8 59.43,12.37 U$4.3 | C14.2 45.62,10.18 v46.2,9.6 | v49.8,20.8 46.8,20.8 | 46.8,20.8 43.4,20.8 v42.6,20 | C16.2 46.7,20.9 46.8,20.8
  Top 0.9: 6.4,14 v6.4,12.4 6.4,9.62 C3.2 | 6.4,14 IC2.4 | v7.2,15.4 7.2,14.8 6.5,14.1 | 6.5,14.1 6.4,14 | 6.5,14.1 6.59,14.01 IC2.2 12.01,14.01 12.2,14.2 | 12.2,14.2 12.8,14.8 13.31,14.8 C8.1 | C4.2 12.07,14.33 12.2,14.2 | C6.2 20.39,4 19.8,3.4 v15,3.4 11.02,3.4 UART.4 | v15,1.2 v16.2,1.2 | v28.8,2.8 v28.8,4 | U$5.2 39.22,10.2 | 39.22,10.2 U$5.1 | v41,10.2 39.22,10.2 | v42.6,20 41.2,21.4 39.4,21.4 v38.8,22
  Bottom 0.2: 49.8,19.11 IC6.31
  Bottom 0.4: v30.4,15.2 30.4,11 30.6,11 30.4,10.8 30.4,9 28.4,7 28.4,4.4 v28.8,4 | v47.4,27.2 IC6.8 IC6.7 | 46.6,29.89 C28.2 | 46.52,27.92 46.6,28 | C29.2 53.32,30.48 v52.4,31.4 | v53.8,25.4 53.8,23.8 54.49,23.11 IC6.21 57.31,23.11 57.31,23.09 57.4,23 57.4,21.6 57.31,21.51 IC6.23 | C25.2 45.28,27.92 | IC6.31 49.78,20.78 v49.8,20.8 51.8,20.8 52.18,20.42 IC6.28 | R16.1 12.22,25.54 R15.1 12.17,25.17 11.6,24.6 v11.6,23 | 49.8,19.11 49.8,16.84 C10.2
  Bottom 0.6: v46.2,9.6 46.2,6.2 v46.4,6 50.94,6 JP3.2 | 57.4,23 62.8,23 | 62.8,23 63,22.8 v63,21.6 63.2,21.6 65,19.8 65,18.21 64.4,17.4 64.25,17.25 C27.1 | 62.8,23 62.8,23.27 C32.2 | C33.2 64.28,28.88 65.5,30.1 65.94,30.1 JP2.4 66.65,30.15 68.58,28.22 C35.2 68.68,20.13 C34.2 68.68,15.43 C7.2 68.58,12.82 v68.6,12.8 | C26.2 63.67,12.47 v64,12.8
  Bottom 0.9: 30.6,11 v34,11 34.8,10.2 v41,10.2 43.8,13 v43.8,16.8 43.8,18.8 43.1,19.5 | v18.4,18.6 18.4,20.6 | 18.4,20.6 18.4,22 17.8,22.6 v17.8,24.6 | v19.2,20.6 18.4,20.6 | v15,3.4 v15,1.2 v16.2,1.2 | v28.8,2.8 v28.8,4 | v47.4,27.2 46.6,28 46.6,29.89 | C25.2 46.52,27.92 | 45.28,27.92 45,28.2 39.5,28.2 LSP2.MP 38.71,24.4 | 43.2,24.6 43.45,24.35 C24.2 43.1,24.72 C23.2 39.03,24.72 38.71,24.4 | 38.71,24.4 38.71,22.09 v38.8,22 | 43.1,19.5 v42.6,20 | C9.2 43.57,19.97 43.1,19.5
  other vias: 54,6.6 11.6,10.2 21.2,21.2 35.2,25.2
  pour Top (isolate 0.254): 70,0 0,0 0,33.02 70,33
  pour Bottom (isolate 0.254): 0,33.02 0,0 70,0 70,33
N$1
  Top 0.2: IC1.24 24.27,6.93 25.66,5.54 C1.2 25.66,3.85 U$1.P$1
N$2
  Top 0.2: IC1.23 23.47,6.93 24.07,6.33 C2.2 24.07,3.83 U$1.P$2
N$3
  Top 0.2: C8.2 14.4,13.8 14.4,15.4 15.7,16.7 IC1.7
N$4
  Top 0.2: IC5.20 47.1,18.9 C16.1
N$5
  Top 0.2: IC4.8 46.36,4.86 47.3,5.8 47.95,5.8 C18.1
N$10
  Top 0.2: IC5.10 46.6,11.6 47.52,10.68 C15.1
N$11
  Top 0.2: IC4.12 44.34,5.26 43.4,6.2 43.4,7.4 44,8 48,8 48.14,7.86 C18.2 48.26,8.14
N$12
  Top 0.2: R5.1 33.85,9.26 35.46,11.06 U$5.4
N$13
  Top 0.2: IC4.10 45.34,6.5 C19.1
N$15
  Top 0.2: C21.1 21.14,24.73 20.4,24 20.4,23.43 IC1.62
N$16
  Top 0.2: IC1.43 33.4,17.5 33.4,14.2 34.62,14.2 HWB-JMP.2
N$17
  Top 0.2: R10.2 32.82,4.98 31,6.8 30.2,6.8 29.87,7.13 IC1.31
N$18
  Top 0.2: R10.1 34.08,3.28 35,4 35,8 35.72,8.91 U$5.3
N$19
  Top 0.2: R5.2 32.03,6.77 31.2,7.6 30.77,7.6 IC1.32
N$20
  Top 0.4: RST-BUTTON.3 RST-BUTTON.4 2,19.3 R11.1
N$21  (via drill 0.4 pad 0.81)
  Top 0.2: v35.8,23.8 59,23.8 62,20.8 62,13.84 U$4.4 | v24,21.2 22.6,21.2 21.07,22.53 IC1.61
  Bottom 0.2: v24,21.2 24.2,21.4 34.8,21.4 36,22.6 36,23.4 35.8,23.6 v35.8,23.8
N$22  (via drill 0.4 pad 0.81)
  Top 0.2: IC1.60 21.87,22.53 22.2,22.2 24.4,22.2 25.8,20.8 v25.8,20.4
  Bottom 0.2: LSP1.MP 36.8,26.11 36.8,22.6 35,20.8 25.8,20.8 v25.8,20.4
N$23
  Bottom 0.2: IC6.2 46.6,21.51 | 46.6,21.51 46.29,21.51 46.2,21.6 45.38,21.6 C9.1 | 46.6,21.51 46.4,21.31 46.4,20 47.2,19.2 47.2,13.8 47.8,13.2 51.29,13.2 R7.2
N$26  (via drill 0.4)
  Top 0.2: X1.2 63.2,10.4 57.4,10.4 v56.8,10
  Bottom 0.2: v56.8,10 55.4,10 53.8,11.6 53.8,12.95 R7.1
N$27  (via drill 0.4)
  Top 0.2: X1.3 64,10.4 63.4,11 56,11 v55.4,11.6
  Bottom 0.2: v55.4,11.6 55.4,13.6 54.2,14.8 50.15,14.8 R6.1
N$28  (via drill 0.4)
  Top 0.2: R12.1 49.06,18.74 v48,19.8
  Bottom 0.2: IC6.1 47.4,19.8 48,19.2 | 48,19.2 v48,19.8 | 48,19.2 48,16.94 C10.1 48.24,14.66 R6.2
N$29
  Bottom 0.2: IC6.4 46.69,23.11 46.2,23.6 46.2,25.32 C25.1 44.38,26.22 43.92,26.68 R8.2
N$31
  Bottom 0.2: IC6.30 50.58,17.82 52.6,15.8 57,15.8 59.6,13.2 Q3.2 | 58.8,9.6 59.55,9.6 Q3.2 | Q3.2 C26.1
N$32
  Bottom 0.2: 59.8,19 56.4,19 56.4,16.6 52.6,16.6 51.38,17.82 IC6.29 | 59.8,19 Q3.1 | 59.8,19 63.59,19 C27.2
N$33  (via drill 0.4)
  Top 0.2: R12.2 49.73,17.6 v53,17.6
  Bottom 0.2: IC6.27 52.98,17.62 v53,17.6
N$41
  Bottom 0.2: IC6.11 50.58,28.62 49.23,29.97 C28.1 48.38,30.82 48,31.2 44.2,31.2 43.92,30.92 R13.2
N$42
  Bottom 0.2: R14.2 40.79,31.39 41.2,31.8 49.78,31.8 C29.1 51.38,29.71 IC6.12
RST  (via drill 0.4 pad 0.9)
  Top 0.2: IC1.20 21.07,6.87 20.8,6.6 15.2,6.6 v13.2,8.6 13.08,8.48 R9.1 10.08,8.48 9.4,7.8 5.41,7.8 C22.2 | R11.2 3.7,17.7 4.4,18.4 v13.4,18.4
  Bottom 0.2: JTAG.6 24.12,30.48 23.8,30.8 18,30.8 17.6,30.4 17.6,29.2 15,26.6 15,22.8 13.2,21 13.2,18.4 | 13.2,18.4 v13.2,8.6 | v13.4,18.4 13.2,18.4
RX  (via drill 0.4)
  Top 0.2: UART.2 5.39,5.59 5.6,5.8 11.2,5.8 12.4,4.6 v18.8,4.6 | v26,9.6 26,9.2 26.67,8.53 IC1.27
  Bottom 0.2: v26,9.6 24.8,9.6 v18.8,4.6
SCL  (via drill 0.4)
  Top 0.2: R3.1 55.66,6.35 55.37,6.35 54.1,7.62 54.1,8.38 52.32,10.16 51.86,10.16 JP3.4 51.74,10.16 51.16,10.16 49.8,8.8 v43.4,8.8 | v42,5.2 42,4.58 41.23,3.8 41,3.8 IC3.14 | IC1.25 25.07,6.93 25.6,6.4 26.6,6.4 27,6 29,6 v29.6,5.4 | v45.6,18 IC5.23 | IC4.1 42.47,2.54 v42.4,2.6
  Bottom 0.2: v29.6,5.4 29.8,5.2 v42,5.2 43.4,5.2 | 43.4,5.2 v43.4,8.8 43.4,10.4 45.6,12.6 v45.6,18 | v42.4,2.6 43.4,3.6 43.4,5.2
SDA  (via drill 0.4)
  Top 0.2: R4.1 55.45,4.03 JP3.3 | v45.4,19.4 44.6,18.6 44.6,17.6 45.1,17.09 IC5.24 | IC3.13 41.31,2.71 v42.6,4 42.6,3.6 43.14,3.06 IC4.16 | IC1.26 25.87,6.93 26,6.8 27,6.8 27.4,6.4 30.6,6.4 31.2,5.8 v31.2,4.2
  Bottom 0.2: 46.6,12.6 46.6,18.2 v45.4,19.4 | v31.2,4.2 41.4,4.2 41.6,4 v42.6,4 41.4,2.8 41.4,2.2 41.8,1.8 43.4,1.8 44.2,2.6 44.2,10.2 46.6,12.6 | 46.6,12.6 46.6,12.4 51.32,7.68 JP3.3
TCK
  Top 0.2: JTAG.1 20.39,25.6 23,25.6 24.27,24.33 IC1.57
TDI
  Top 0.2: IC1.54 26.67,24.4 JTAG.9
TDO
  Top 0.2: JTAG.3 22.85,28.2 24.8,28.2 25.4,27.6 25.4,26 25.87,25.53 IC1.55
TMS
  Top 0.2: JTAG.5 24.13,25.67 25.07,24.73 IC1.56
TX  (via drill 0.4)
  Top 0.2: UART.3 7.93,2.47 8.4,2 11,2 11.4,2.4 v20.6,2.4 | v28,9.6 28,9 27.47,8.47 IC1.28
  Bottom 0.2: v28,9.6 27.8,9.6 v20.6,2.4

### Text on the board
Top: AST.013.02 | JTAG | 2 | 1 | RST | L1
Bottom: L2
tValues: JP3 OSADIT ZESPODU
bDocu: SEN-10724